# EAGLE design first designbr (EAGLE 7.5.0)
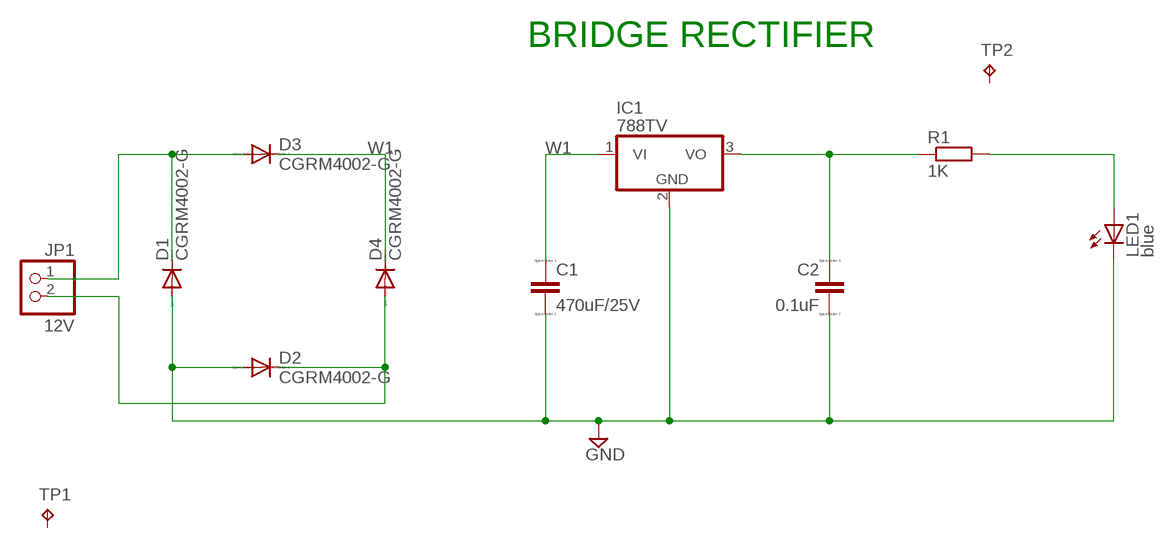
[diagram p0: schematic, sheet 1]

## Parts
C1  470uF/25V  CC1206  [C1206]
C2  0.1uF  CC1206  [C1206]
D1  CGRM4002-G  DIODE-1SOD323-W  [SOD323-W]
D2  CGRM4002-G  DIODE-SOD323-W  [SOD323-W]
D3  CGRM4002-G  DIODE-1SOD323-W  [SOD323-W]
D4  CGRM4002-G  DIODE-1SOD323-W  [SOD323-W]
IC1  788TV  [TO220V]
JP1  12V  PINHD-1X2  [1X02]
LED1  blue  LED5MM  [LED5MM]
R1  1K  R-EU_M0805  [M0805]
TP1  TPTP11R  [TP11R]
TP2  TPTP11R  [TP11R]

## Nets
GND: C1.2 C2.2 D1.A D2.A IC1.2(GND) LED1.K(C)
N$1: D1.C D3.A JP1.1
N$5: D2.C D4.A JP1.2
N$6: C2.1 IC1.3(VO) R1.1
N$7: LED1.A R1.2
W1: C1.1 D3.C D4.C IC1.1(VI)
Unconnected: TP1.TP TP2.TP

## Notes on the sheet
- BRIDGE RECTIFIER

## Library data of the parts
C1 C2 = eagle-ltspice:C: CAPACITOR, European symbol; SPICEMODEL: NONE; SPICEPREFIX: C
D1-D4 = diode:DIODE-: DIODE
IC1 = linear:78*: Positive VOLTAGE REGULATOR Source: http://cache.national.com/ds/LM/LM78L05.pdf http://www.fairchildsemi.com/ds/LM/LM7805.pdf
JP1 = pinhead:PINHD-1X2: PIN HEADER
LED1 = led:LED: LED OSRAM: - CHIPLED LG R971, LG N971, LY N971, LG Q971, LY Q971, LO R971, LY R971 LH N974, LH R974 LS Q976, LO Q976, LY Q976 LO Q996 - Hyper CHIPLED LW Q18S LB Q993, LB Q99A, LB R99A - SideLED LS A670, LO A670, LY A670, LG A670, LP A670 LB A673, LV A673, LT A673, LW A673 LH A674 LY A675 LS A676, LA A676, LO A676, LY A676, LW A676 LS A679, LY A679, LG A679 - Hyper Micro SIDELED® LS Y876, LA Y876, LO Y876, LY Y876 LT Y87S - SmartLED LW L88C, LW L88S LB L89C, LB L89S, LG L890 LS L89K, LO L89K, LY L89K LS L896, LA L896, LO L896, LY L896 - TOPLED LS T670, LO T670, LY T670, LG T670, LP T670 LSG T670, LSP T670, LSY T670, LOP T670, LYG T670 LG T671, LOG T671, LSG T671 LB T673, LV T673, LT T673, LW T673 LH T674 LS T676, LA T676, LO T676, LY T676, LB T676, LH T676, LSB T676, LW T676 LB T67C, LV T67C, LT T67C, LS T67K, LO T67K, LY T67K, LW E67C LS E67B, LA E67B, LO E67B, LY E67B, LB E67C, LV E67C, LT E67C LW T67C LS T679, LY T679, LG T679 LS T770, LO T770, LY T770, LG T770, LP T770 LB T773, LV T773, LT T773, LW T773 LH T774 LS E675, LA E675, LY E675, LS T675 LS T776, LA T776, LO T776, LY T776, LB T776 LHGB T686 LT T68C, LB T68C - Hyper Mini TOPLED® LB M676 - Mini TOPLED Santana® LG M470 LS M47K, LO M47K, LY M47K Source: http://www.osram.convergy.de LUXEON: - LUMILED® LXK2-PW12-R00, LXK2-PW12-S00, LXK2-PW14-U00, LXK2-PW14-V00 LXK2-PM12-R00, LXK2-PM12-S00, LXK2-PM14-U00 LXK2-PE12-Q00, LXK2-PE12-R00, LXK2-PE12-S00, LXK2-PE14-T00, LXK2-PE14-U00 LXK2-PB12-K00, LXK2-PB12-L00, LXK2-PB12-M00, LXK2-PB14-N00, LXK2-PB14-P00, LXK2-PB14-Q00 LXK2-PR12-L00, LXK2-PR12-M00, LXK2-PR14-Q00, LXK2-PR14-R00 LXK2-PD12-Q00, LXK2-PD12-R00, LXK2-PD12-S00 LXK2-PH12-R00, LXK2-PH12-S00 LXK2-PL12-P00, LXK2-PL12-Q00, LXK2-PL12-R00 Source: www.luxeon.com KINGBRIGHT: KA-3528ASYC Source: www.kingbright.com
R1 = rcl:R-EU_: RESISTOR, European symbol
TP1 TP2 = testpad:TP: Test pad

## Board
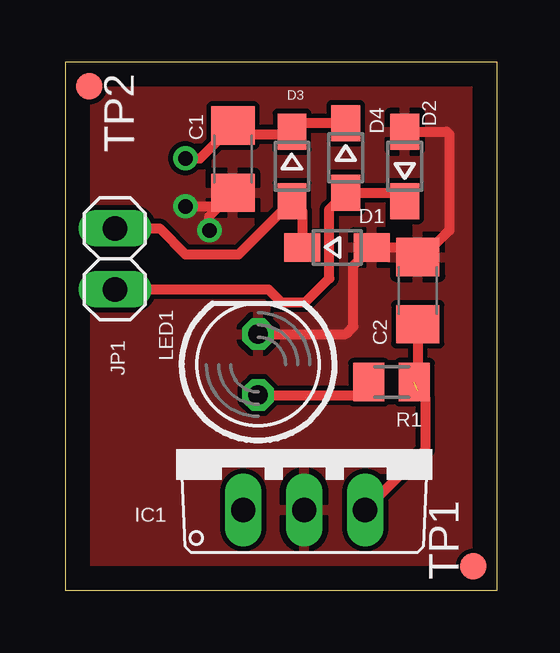
[diagram p1: board, top side]
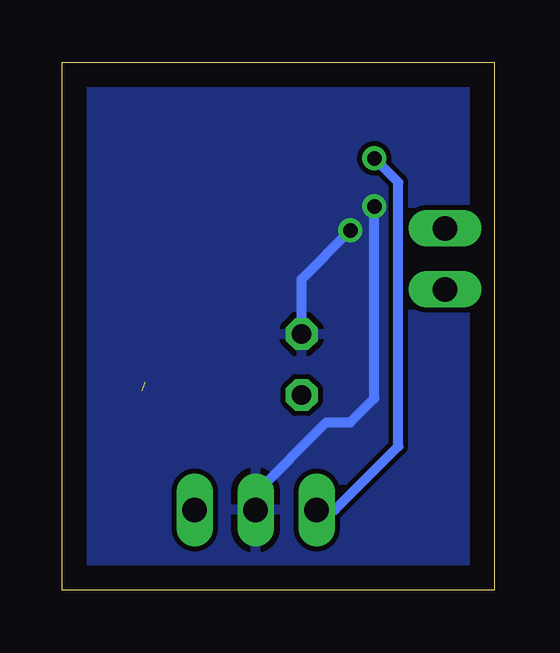
[diagram p2: board, bottom side, seen from below]

Size 18 x 22 mm. Coordinates in mm from the lower left corner, seen from the top.
Outline: 0,0 18,0 18,22 0,22 0,0
Copper layers (1*16): Top 0.035mm / dielectric 1.5mm / Bottom 0.035mm
Design rules "default": minimum track width 10mil, minimum drill 24mil, track to track 8mil, track to pad 8mil, pad to pad 8mil, via to via 8mil, smd to smd 8mil, copper to edge 40mil, drill to drill 8mil, minimum pad ring 10mil, minimum via ring 8mil, stop-mask expansion 4mil, vias tented up to drill 0mil, thermal gap 10mil

### Footprints (pad centres in the part's own frame; a part is rotated, then mirrored left to right if it is on the bottom)
C1206 = smd 1.6 x 1.8: 1 -1.4,0; 2 1.4,0
SOD323-W = smd 1.5 x 1.2: A 1.45,0; C -1.45,0
TO220V = drill 1.016 long: 1 -2.54,-2.54; 2 0,-2.54; 3 2.54,-2.54
1X02 = drill 1.016 long: 1 -1.27,0; 2 1.27,0
LED5MM = drill 0.813 octagon: A -1.27,0; K 1.27,0
M0805 = smd 1.3 x 1.6: 1 -0.95,0; 2 0.95,0
TP11R = smd 1.1 x 1.1: TP 0,0

### Placement (x,y rotation side)
C1  6.98,17.97 270 top
C2  14.68,12.49 90 top
D1  11.32,14.29 0 top
D2  14.14,17.67 90 top
D3  9.44,17.67 270 top
D4  11.68,18.02 270 top
IC1  9.95,5.89 0 top
JP1  2.06,13.81 270 top
LED1  8.03,9.41 90 top
R1  13.59,8.68 180 top
TP1  17,1 90 top
TP2  1,21 270 top

### Tracks (layer width: path | path; a pad name or v marks a point on that pad's centre or on a via)
GND  (via drill 0.6 pad 0.25)
  Top 0.406: 14.14,14.43 14.28,14.29 | 14.28,14.29 C2.2 14.79,14 15,14 16,15 16,19 15.88,19.12 D2.A | 14.28,14.29 D1.A 12,13.52 12,11 11.68,10.68 LED1.K | v6,15 6,15.59 C1.2 6.41,16 v5,16
  Bottom 0.406: IC1.2 9.95,4.05 7,7 6,7 5,8 v5,16 | LED1.K 8.03,12.97 v6,15
  pour Top: 0,22 18,22 18,0 0,0
  pour Bottom: 0,22 18,22 18,20 18,0 0,0 0,1
N$1
  Top 0.406: JP1.1 3.92,15.08 5,14 7.22,14 D3.A 9.87,15.79 D1.C
N$5
  Top 0.406: D2.C 13.79,16.57 D4.A 11,15.89 11,13 10,12 9,12 8.46,12.54 JP1.2
N$6  (1 unrouted)
  Top 0.406: C2.1 14.68,8.32 15,8 15,5.86 IC1.3
N$7
  Top 0.406: LED1.A 12.1,8.14 R1.2
W1  (via drill 0.6 pad 0.25)
  Top 0.406: D4.C 9.79,19.47 D3.C | 9.19,19.37 D3.C | v5,18 5.61,18 C1.1 6.98,19.02 7,19 9.32,19 D3.C
  Bottom 0.406: IC1.1 6.65,3.35 4,6 4,17 v5,18